# Altium schematic sheet vg93.SCHDOC
size 595 x 420 mm; DocumentNumber: Pentagon 128; SheetNumber: 4; SheetTotal: 5; DocumentName: Sheet4.SCHDOC
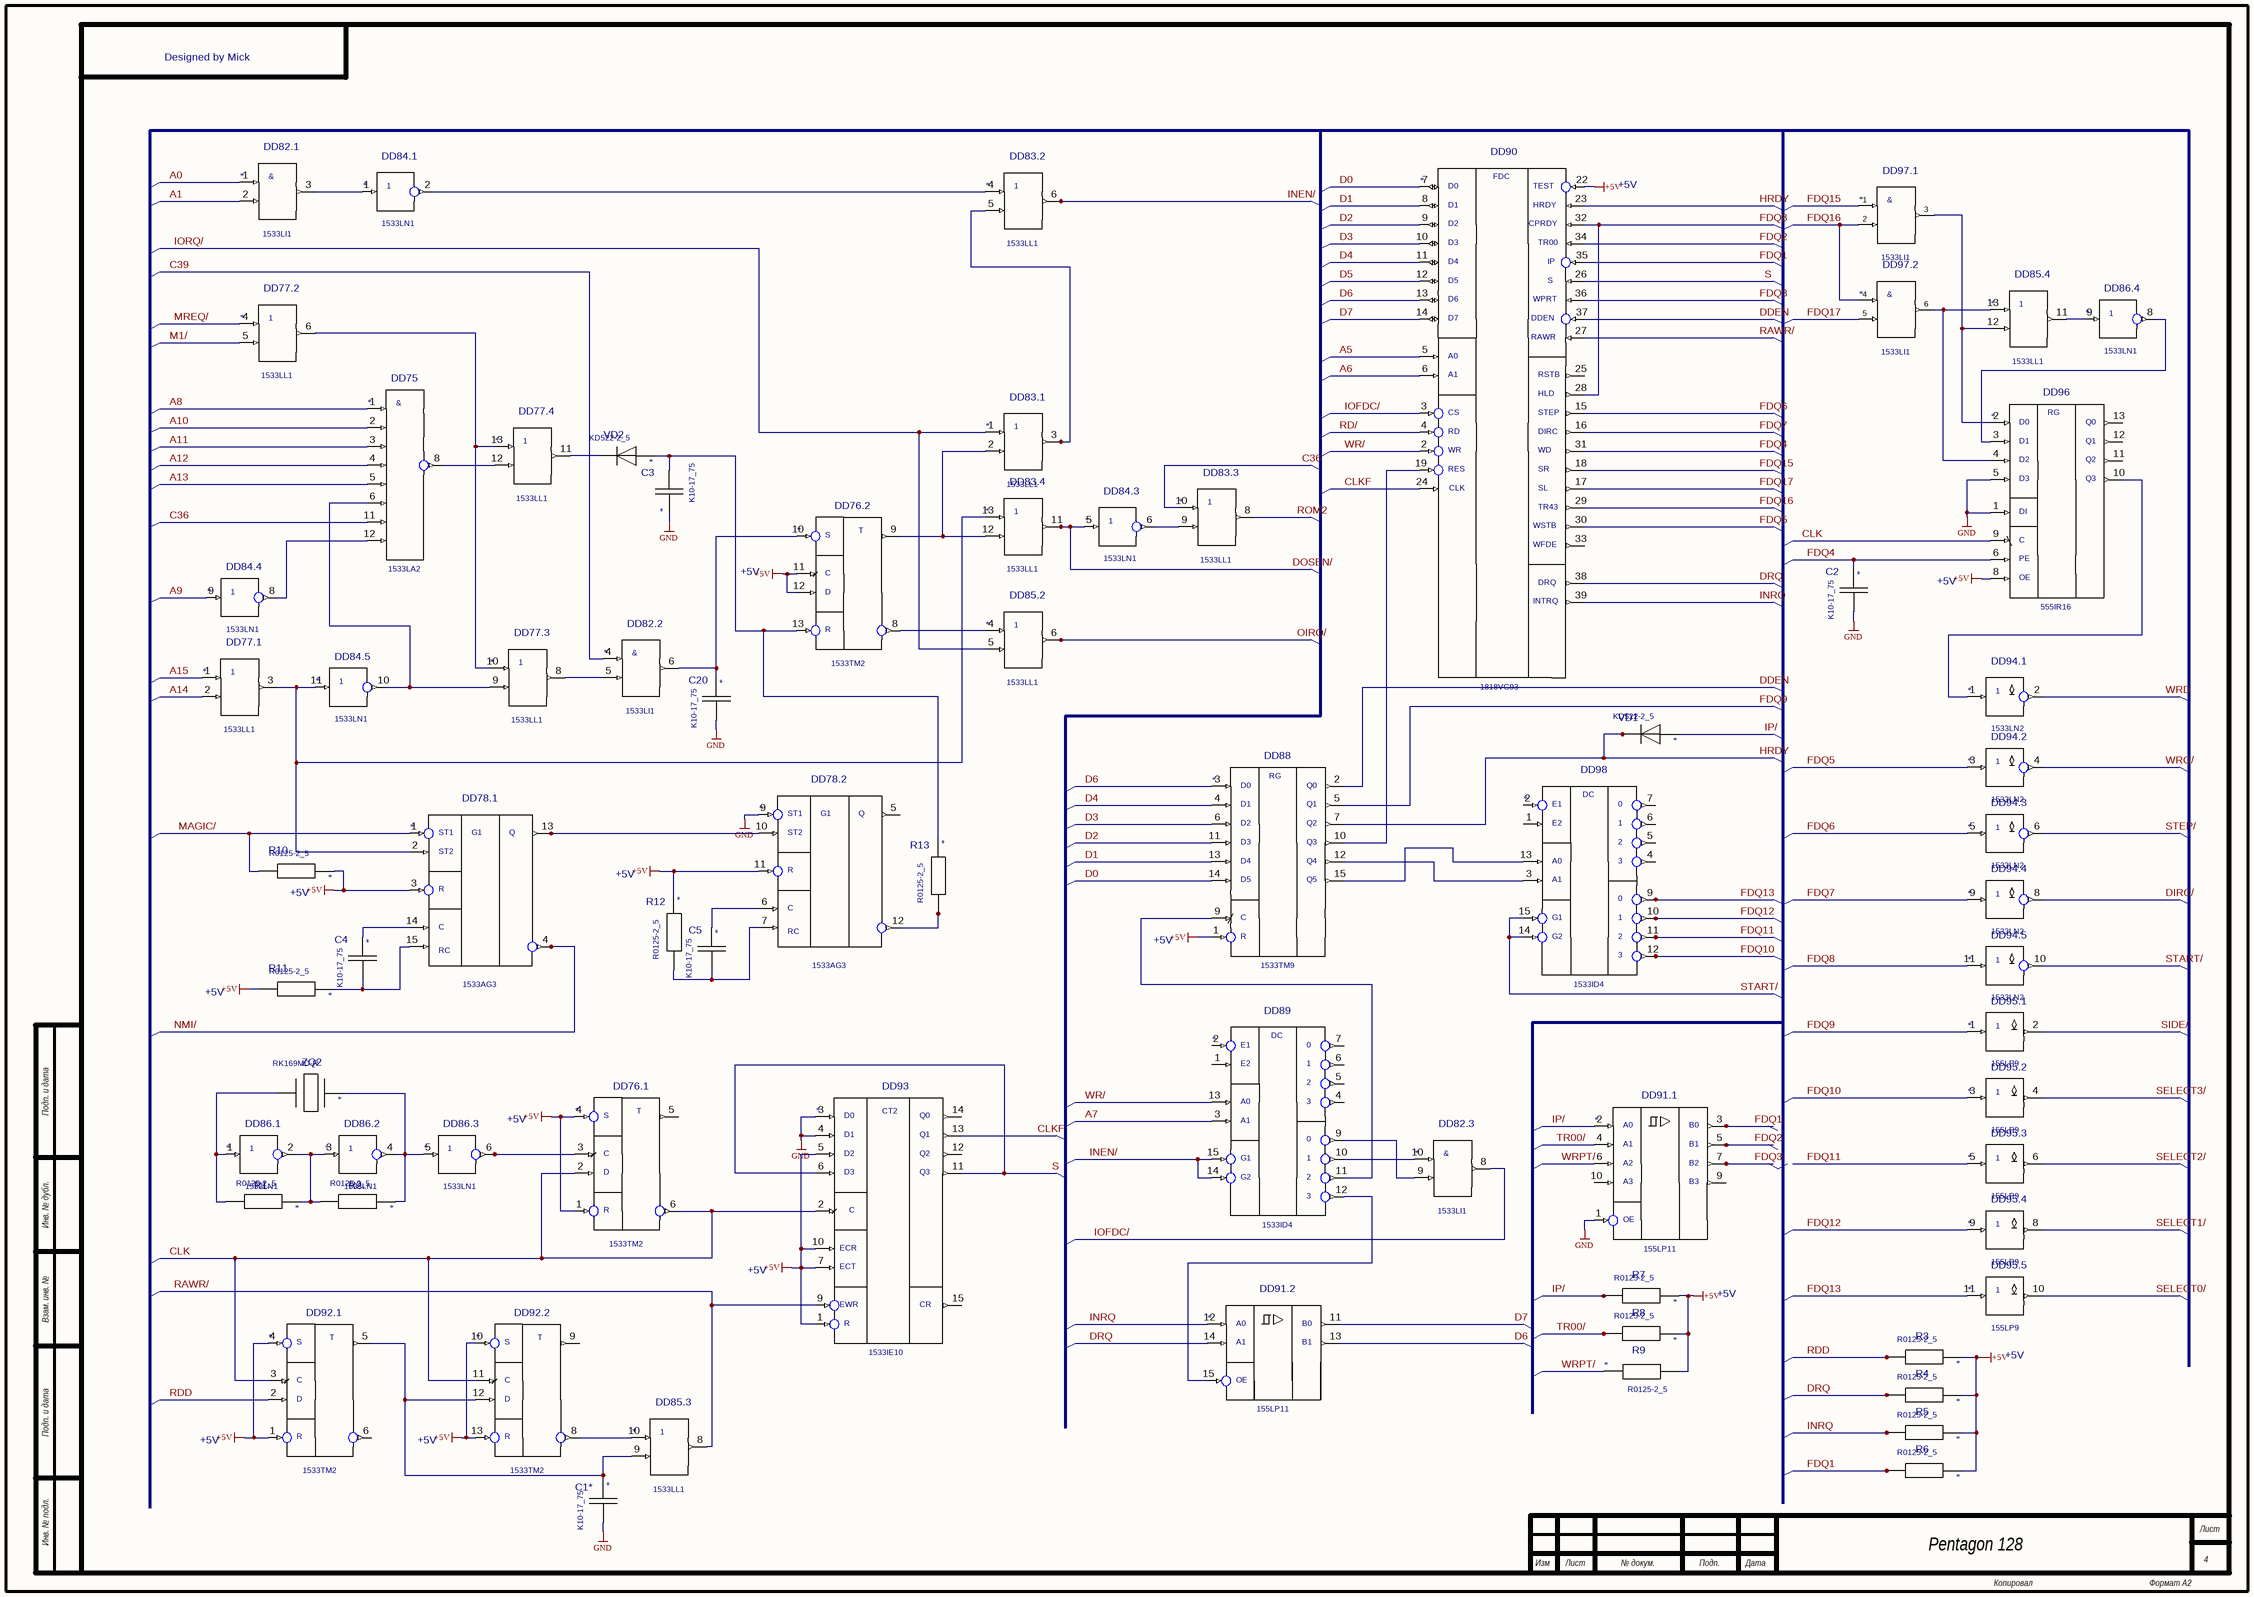
[diagram p0: vg93.SCHDOC]

## Parts
C1  K10-17_75  [K10-17_75]
C2  K10-17_75  [K10-17_75]
C3  K10-17_75  [K10-17_75]
C4  K10-17_75  [K10-17_75]
C5  K10-17_75  [K10-17_75]
C6  K10-17_75  [K10-17_75]
DD1  1533LI1  [DIP14]  (parts A,B,C of 4)
DD2  1818VG93  [DIP40_15]
DD3  1533LN1  [DIP14]  (parts A,B,C,D,E of 6)
DD4  1533LL1  [DIP14]  (parts A,B,C,D of 4)
DD5  1533LI1  [DIP14]  (parts A,B of 4)
DD6  1533LL1  [DIP14]  (parts A,B,C,D of 4)
DD7  1533LA2  [DIP14]
DD8  555IR16  [DIP14]
DD9  1533LL1  [DIP14]  (parts B,C,D of 4)
DD10  1533TM2  [DIP14]  (parts A,B of 2)
DD11  1533LN1  [DIP14]  (parts A,C,D of 6)
DD12  1533LN2  [DIP14]  (parts A,B,C,D,E of 6)
DD13  1533TM9  [DIP16]
DD14  1533ID4  [DIP16]
DD15  1533AG3  [DIP16]  (parts A,B of 2)
DD16  155LP9  [DIP14]  (parts A,B,C,D,E of 6)
DD17  1533ID4  [DIP16]
DD18  1533IE10  [DIP16]
DD19  155LP11  [DIP16]  (parts A,B of 2)
DD20  1533TM2  [DIP14]  (parts A,B of 2)
R1  R0125-2_5  [R0125-2_5]
R2  R0125-2_5  [R0125-2_5]
R3  R0125-2_5  [R0125-2_5]
R4  R0125-2_5  [R0125-2_5]
R5  R0125-2_5  [R0125-2_5]
R6  R0125-2_5  [R0125-2_5]
R7  R0125-2_5  [R0125-2_5]
R8  R0125-2_5  [R0125-2_5]
R9  R0125-2_5  [R0125-2_5]
R10  R0125-2_5  [R0125-2_5]
R11  R0125-2_5  [R0125-2_5]
R12  R0125-2_5  [R0125-2_5]
R13  R0125-2_5  [R0125-2_5]
VD1  KD522-2_5  [KD522-2_5]
VD2  KD522-2_5  [KD522-2_5]
ZQ1  RK169MD-R  [RK169MD-R]

## Nets
+5V: DD2.22(TEST) DD5.14(+5V) DD8.8(OE) DD10.1(R) DD10.4(S) DD10.11(C) DD10.12(D) DD13.1(R) DD15.3(R) DD15.11(R) DD18.1(R) DD18.5(D2) DD18.7(ECT) DD18.10(ECR) DD20.1(R) DD20.4(S) DD20.10(S) DD20.13(R) R2.1(A) R3.1(A) R4.2(B) R7.1(A) R8.2(B) R9.1(A) R10.1(A) R11.1(A) R12.1(A) R13.1(A)
GND: C1.1(A) C2.2(B) C3.2(B) C6.2(B) DD5.7(GND) DD8.1(DI) DD8.5(D3) DD15.9(ST1) DD18.3(D0) DD18.4(D1) DD19.1(OE)
A0: DD1.1(A)
A1: DD1.2(B)
A5: DD2.5(A0)
A6: DD2.6(A1)
A7: DD17.3(A1)
A8: DD7.1(A)
A9: DD11.9(A)
A10: DD7.2(B)
A11: DD7.3(C)
A12: DD7.4(D)
A13: DD7.5(E)
A14: DD6.2(B)
A15: DD6.1(A)
C36: DD4.10(A) DD7.11(G)
C39: DD1.4(A)
CLK: DD8.9(C) DD10.2(D) DD10.6(Q/) DD18.2(C) DD20.3(C) DD20.11(C)
CLKF: DD2.24(CLK) DD18.13(Q1)
D0: DD2.7(D0) DD13.14(D5)
D1: DD2.8(D1) DD13.13(D4)
D2: DD2.9(D2) DD13.11(D3)
D3: DD2.10(D3) DD13.6(D2)
D4: DD2.11(D4) DD13.4(D1)
D5: DD2.12(D5)
D6: DD2.13(D6) DD13.3(D0) DD19.13(B11)
D7: DD2.14(D7) DD19.11(B10)
DDEN: DD2.37(DDEN) DD13.2(Q0)
DIRC/: DD12.8(B)
DOSEN/: DD3.5(A) DD9.11(C)
DRQ: DD2.38(DRQ) DD19.14(A11) R11.2(B)
FDQ1: DD2.35(IP) DD19.3(B0) R13.2(B)
FDQ2: DD2.34(TR00) DD19.5(B1)
FDQ3: DD2.36(WPRT) DD19.7(B2)
FDQ4: C2.1(A) DD2.31(WD) DD8.6(PE)
FDQ5: DD2.30(WSTB) DD12.3(A)
FDQ6: DD2.15(STEP) DD12.5(A)
FDQ7: DD2.16(DIRC) DD12.9(A)
FDQ8: DD2.28(HLD) DD2.32(CPRDY) DD12.11(A)
FDQ9: DD13.5(Q1) DD16.1(A)
FDQ10: DD14.12(Q7) DD16.3(A)
FDQ11: DD14.11(Q6) DD16.5(A)
FDQ12: DD14.10(Q5) DD16.9(A)
FDQ13: DD14.9(Q4) DD16.11(A)
FDQ15: DD2.18(SR) DD5.1(A)
FDQ16: DD2.29(TR43) DD5.2(B) DD5.4(A)
FDQ17: DD2.17(SL) DD5.5(B)
HRDY: DD2.23(HRDY) DD13.7(Q2) VD2.2(B)
INEN/: DD4.6(C) DD17.14(G2) DD17.15(G1)
INRQ: DD2.39(INTRQ) DD19.12(A10) R12.2(B)
IOFDC/: DD1.8(C) DD2.3(CS)
IORQ/: DD4.1(A) DD9.5(B)
IP/: DD19.2(A0) R7.2(B) VD2.1(A)
M1/: DD6.5(B)
MAGIC/: DD15.1(ST1) R2.2(B)
MREQ/: DD6.4(A)
NMI/: DD15.4(Q/)
OIRQ/: DD9.6(C)
RAWR/: DD2.27(RAWR) DD9.8(C) DD18.9(EWR)
RD/: DD2.4(RD)
RDD: DD20.2(D) R10.2(B)
ROM2: DD4.8(C)
S: DD2.26(S) DD18.6(D3) DD18.11(Q3)
SELECT0/: DD16.10(B)
SELECT1/: DD16.8(B)
SELECT2/: DD16.6(B)
SELECT3/: DD16.4(B)
SIDE/: DD16.2(B)
START/: DD12.10(B) DD14.14(G2) DD14.15(G1)
STEP/: DD12.6(B)
TR00/: DD19.4(A1) R9.2(B)
WR/: DD2.2(WR) DD17.13(A0)
WRD: DD12.2(B)
WRG/: DD12.4(B)
WRPT/: DD19.6(A2) R8.1(A)
NetC1_2: C1.2(B) DD10.13(R) R1.1(A) VD1.1(A)
NetC3_1: C3.1(A) DD1.6(C) DD10.10(S)
NetC4_1: C4.1(A) DD15.6(C)
NetC4_2: C4.2(B) DD15.7(RC) R3.2(B)
NetC5_1: C5.1(A) DD15.14(C)
NetC5_2: C5.2(B) DD15.15(RC) R4.1(A)
NetC6_1: C6.1(A) DD9.9(B) DD20.5(Q) DD20.12(D)
NetDD1_3: DD1.3(C) DD3.1(A)
NetDD1_5: DD1.5(B) DD6.8(C)
NetDD1_9: DD1.9(B) DD17.9(Q4)
NetDD1_10: DD1.10(A) DD17.10(Q5)
NetDD2_19: DD2.19(RES) DD13.10(Q3)
NetDD3_2: DD3.2(B) DD4.4(A)
NetDD3_3: DD3.3(A) DD11.2(B) R5.1(A) R6.2(B)
NetDD3_4: DD3.4(B) DD11.5(A) R6.1(A) ZQ1.1(A)
NetDD3_6: DD3.6(B) DD4.9(B)
NetDD3_8: DD3.8(B) DD8.3(D1)
NetDD3_9: DD3.9(A) DD4.11(C)
NetDD3_10: DD3.10(B) DD6.9(B) DD7.6(F)
NetDD3_11: DD3.11(A) DD6.3(C) DD9.13(A) DD15.2(ST2)
NetDD4_2: DD4.2(B) DD9.12(B) DD10.9(Q)
NetDD4_3: DD4.3(C) DD4.5(B)
NetDD4_12: DD4.12(B) DD5.3(C) DD8.2(D0)
NetDD4_13: DD4.13(A) DD5.6(C) DD8.4(D2)
NetDD6_6: DD6.6(C) DD6.10(A) DD6.13(A)
NetDD6_11: DD6.11(C) VD1.2(B)
NetDD6_12: DD6.12(B) DD7.8(Y)
NetDD7_12: DD7.12(H) DD11.8(B)
NetDD8_10: DD8.10(Q3) DD12.1(A)
NetDD9_4: DD9.4(A) DD10.8(Q/)
NetDD9_10: DD9.10(A) DD20.8(Q/)
NetDD10_3: DD10.3(C) DD11.6(B)
NetDD11_1: DD11.1(A) R5.2(B) ZQ1.2(B)
NetDD13_9: DD13.9(C) DD17.11(Q6)
NetDD13_12: DD13.12(Q4) DD14.3(A1)
NetDD13_15: DD13.15(Q5) DD14.13(A0)
NetDD15_10: DD15.10(ST2) DD15.13(Q)
NetDD15_12: DD15.12(Q/) R1.2(B)
NetDD17_12: DD17.12(Q7) DD19.15(OE1)

Not connected (* = marked no-connect by the designer): DD1 7(GND) 14(+5V); DD2 1 20(GND) 21(+5V) 25(RSTB) 33(WFDE) 40(+12V); DD3 7(GND) 14(+5V); DD4 7(GND) 14(+5V); DD6 7(GND) 14(+5V); DD7 7(GND) 9 10 13 14(+5V); DD8 7(GND) 11(Q2) 12(Q1) 13(Q0) 14(+5V); DD9 7(GND) 14(+5V); DD10 5(Q) 7(GND) 14(+5V); DD11 7(GND) 14(+5V); DD12 7(GND) 14(+5V); DD13 8(GND) 16(+5V); DD14 1(E2) 2(E1) 4(Q3) 5(Q2) 6(Q1) 7(Q0) 8(GND) 16(+5V); DD15 5(Q) 8(GND) 16(+5V); DD16 7(GND) 14(+5V); DD17 1(E2) 2(E1) 4(Q3) 5(Q2) 6(Q1) 7(Q0) 8(GND) 16(+5V); DD18 8(GND) 12(Q2) 14(Q0) 15(CR) 16(+5V); DD19 8(GND) 9(B3) 10(A3) 16(+5V); DD20 6(Q/) 7(GND) 9(Q) 14(+5V)

## Notes on the sheet
- Designed by Mick
- (near DD1) DD82.1
- (near DD3) DD84.1
- (near DD4) DD83.2
- (near DD2) DD90
- (near DD5) DD97.1
- +5V
- (near DD5) DD97.2
- (near DD6) DD77.2
- (near DD4) DD85.4
- (near DD3) DD86.4
- (near DD7) DD75
- (near DD6) DD77.4
- (near DD4) DD83.1
- (near DD8) DD96
- (near VD1) VD2
- C3
- (near DD10) DD76.2
- DD83.4
- (near DD3) DD84.3
- (near DD4) DD83.3
- (near DD11) DD84.4
- (near DD9) DD85.2
- (near C2) C2
- DD77.1
- (near DD6) DD77.3
- (near DD1) DD82.2
- (near DD3) DD84.5
- (near C3) C20
- (near DD12) DD94.1
- (near VD2) VD1
- (near DD12) DD94.2
- (near DD15) DD78.2
- (near DD13) DD88
- (near DD14) DD98
- (near DD15) DD78.1
- (near DD12) DD94.3
- (near R2) R10
- (near R2) +5V
- (near R1) R13
- (near DD12) DD94.4
- (near R3) R12
- C5
- (near DD12) DD94.5
- (near R4) R11
- (near C5) C4
- (near DD17) DD89
- DD95.1
- (near ZQ1) ZQ2
- (near DD16) DD95.2
- DD86.1
- DD86.2
- (near DD11) DD86.3
- (near DD10) DD76.1
- (near DD18) DD93
- (near DD1) DD82.3
- (near DD19) DD91.1
- (near DD16) DD95.3
- (near R5) R1
- (near R6) R2
- (near DD16) DD95.4
- (near DD16) DD95.5
- (near DD20) DD92.1
- (near DD20) DD92.2
- (near DD19) DD91.2
- R8
- (near R7) R7
- R9
- (near R10) R3
- (near DD9) DD85.3
- R5
- R4
- R6
- (near C6) C1*
- Подп. и дата
- Инв. № дубл.
- Взам. инв. №
- Инв. № подл.
- Изм
- Лист
- № докум.
- Подп.
- Дата
- Копировал
- Формат A2
- (in symbol 555IR16) RG
- (in symbol 1533AG3, part A) G1
- (in symbol 1533AG3, part B) G1
- (in symbol 1533ID4) DC; 0
- (in symbol 1533IE10) CT2
- (in symbol 1533LA2) &
- (in symbol 1533LI1, part A) &
- (in symbol 1533LI1, part B) &
- (in symbol 1533LI1, part C) &
- (in symbol 1533LI1_VARIANT_1, part A) &
- (in symbol 1533LI1_VARIANT_1, part B) &
- (in symbol 1533TM2, part A) T
- (in symbol 1533TM2, part B) T
- (in symbol 1533TM9) RG
- (in symbol 1818VG93) FDC

## Library data of the parts
DD5 = 1533LI1_VARIANT_1: Value: *
C1-C6 = K10-17_75: Value: *
DD1 = 1533LI1: Value: *
DD2 = 1818VG93: Value: *
DD3 DD11 = 1533LN1: Value: *
DD4 DD6 DD9 = 1533LL1: Value: *
DD7 = 1533LA2: Value: *
DD8 = 555IR16: Value: *
DD10 DD20 = 1533TM2: Value: *
DD12 = 1533LN2: Value: *
DD13 = 1533TM9: Value: *
DD14 DD17 = 1533ID4: Value: *
DD15 = 1533AG3: Value: *
DD16 = 155LP9: Value: *
DD18 = 1533IE10: Value: *
DD19 = 155LP11: Value: *
R1-R13 = R0125-2_5: Value: *
VD1 VD2 = KD522-2_5: Value: *
ZQ1 = RK169MD-R: Value: *